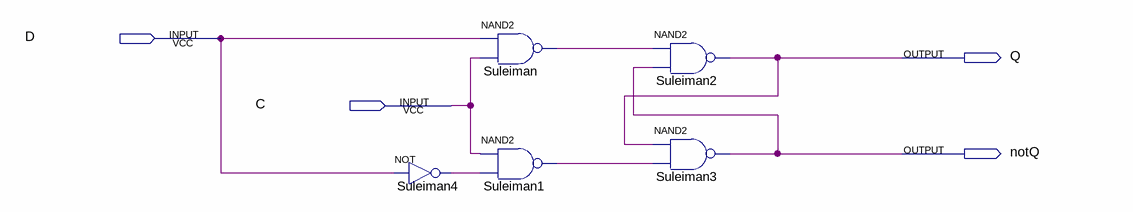
[diagram p0: schematic sheet]
// Quartus schematic Suleiman_DLatch.bdf as structural Verilog: 5 symbols, 4 pins
module Suleiman_DLatch (
  input  D,
  input  C,
  output Q,
  output notQ
);

  wire Suleiman1_out, Suleiman4_out, Suleiman_out;

  not Suleiman4 (Suleiman4_out, D);
  nand Suleiman (Suleiman_out, D, C);
  nand Suleiman1 (Suleiman1_out, C, Suleiman4_out);
  nand Suleiman2 (Q, Suleiman_out, notQ);
  nand Suleiman3 (notQ, Q, Suleiman1_out);
endmodule
